# Altium schematic sheet Mach_PCB.SchDoc
size A4
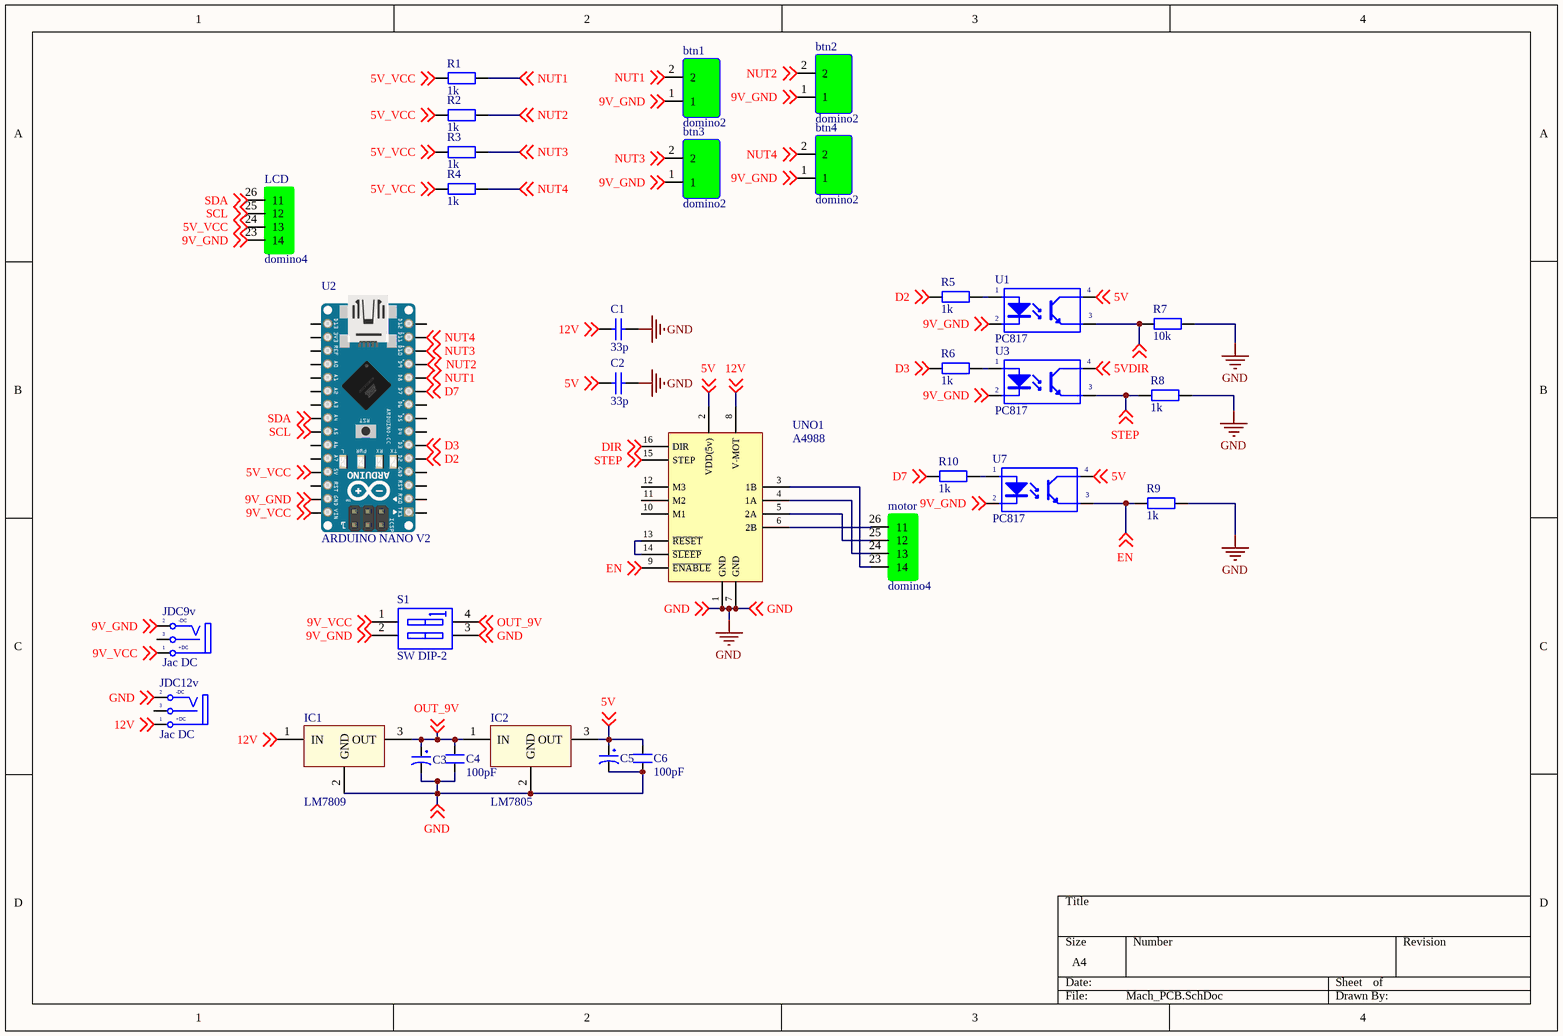
[diagram p0: Mach_PCB.SchDoc]

## Parts
btn1  domino2  [domino2]
btn2  domino2  [domino2]
btn3  domino2  [domino2]
btn4  domino2  [domino2]
C1  value 33p  [Tu-ceramic]  (hidden comment: Capacitor Ceramic)
C2  value 33p  [Tu-ceramic]  (hidden comment: Capacitor Ceramic)
C3  100uF/35V  [CP1.5/3.4]  (value not drawn)
C4  100pF  [CN1]
C5  100uF/35V  [CP1.5/3.4]  (value not drawn)
C6  100pF  [CN1]
IC1  LM7809  [QTO-220]
IC2  LM7805  [QTO-220]
JDC9v  Jac DC  [DC-IN]
JDC12v  Jac DC  [DC-IN]
LCD  domino4  [domino4]
motor  domino4  [domino4]
R1  1k  [R1/4W]
R2  1k  [R1/4W]
R3  1k  [R1/4W]
R4  1k  [R1/4W]
R5  1k  [R1/4W]
R6  1k  [R1/4W]
R7  10k  [R1/4W]
R8  1k  [R1/4W]
R9  1k  [R1/4W]
R10  1k  [R1/4W]
S1  SW DIP-2  [DIP2]
U1  PC817  [DIP4/W0.3]
U2  ARDUINO NANO V2  [ARDUINO NANO]
U3  PC817  [DIP4/W0.3]
U7  PC817  [DIP4/W0.3]
UNO1  A4988  [A4988(driver)]

## Nets
GND: C1.1 C2.1 C3.2 C4.2 C5.2 C6.2 IC1.2(GND) IC2.2(GND) JDC12v.2(TN) R7.2 R8.2 R9.2 S1.3(B2) UNO1.1(GND) UNO1.7(GND) ; off-sheet GND
5V: C2.2 C5.1 C6.1 IC2.3(OUT) U1.4(C) U3.4(C) U7.4(C) UNO1.2(VDD(5v)) ; off-sheet 5V
5V_VCC: LCD.24(13) R1.1 R2.1 R3.1 R4.1 U2.27(5V) ; off-sheet 5V_VCC
9V_GND: btn1.1 btn2.1 btn3.1 btn4.1 JDC9v.2(TN) LCD.23(14) S1.2(A2) U1.2(K) U2.29(GND) U3.2(K) U7.2(K) ; off-sheet 9V_GND
9V_VCC: JDC9v.1(T) S1.1(A1) U2.30(VIN) ; off-sheet 9V_VCC
12V: C1.2 IC1.1(IN) JDC12v.1(T) UNO1.8(V-MOT) ; off-sheet 12V
D2: R5.1 U2.5(D2) ; off-sheet D2
D3: R6.1 U2.6(D3) ; off-sheet D3
D7: R10.1 U2.10(D7) ; off-sheet D7
DIR: R7.1 U1.3(E) UNO1.16(DIR) ; off-sheet DIR
EN: R9.1 U7.3(E) UNO1.9(~{ENABLE}) ; off-sheet EN
NUT1: btn1.2 R1.2 U2.11(D8) ; off-sheet NUT1
NUT2: btn2.2 R2.2 ; off-sheet NUT2
NUT3: btn3.2 R3.2 U2.13(D10) ; off-sheet NUT3
NUT4: btn4.2 R4.2 U2.14(D11) ; off-sheet NUT4
OUT_9V: C3.1 C4.1 IC1.3(OUT) IC2.1(IN) S1.4(B1) ; off-sheet OUT_9V
SCL: LCD.25(12) U2.24(A5) ; off-sheet SCL
SDA: LCD.26(11) U2.23(A4) ; off-sheet SDA
STEP: R8.1 U3.3(E) UNO1.15(STEP) ; off-sheet STEP
Netmotor_23: motor.23(14) UNO1.3(1B)
Netmotor_24: motor.24(13) UNO1.4(1A)
Netmotor_25: motor.25(12) UNO1.5(2A)
Netmotor_26: motor.26(11) UNO1.6(2B)
NetR5_2: R5.2 U1.1(A)
NetR6_2: R6.2 U3.1(A)
NetR10_2: R10.2 U7.1(A)
NetUNO1_13: UNO1.13(~{RESET}) UNO1.14(~{SLEEP})

Not connected (* = marked no-connect by the designer): JDC9v 3(S); JDC12v 3(S); U2 1(TX) 2(RX) 4(GND) 7(D4) 8(D5) 9(D6) 12(D9) 15(D12) 16(D13) 17(3V3) 18(AREF) 19(A0) 20(A1) 21(A2) 22(A3) 25(A6) 26(A7) 28(RST) RST(3); UNO1 10(M1) 11(M2) 12(M3)

## Notes on the sheet
- Labels drawn without touching a wire or pin: NUT2
- (in symbol DCIN) -DC; +DC

## Library data of the parts
C1 C2 = CapDecop: Capacitor; Published: 8-Jun-2000; LatestRevisionDate: 17-Jul-2002; LatestRevisionNote: Re-released for DXP Platform.; PackageReference: RAD-0.3; Publisher: Altium Limited
C3 C5 = CP3: Cap 100uF/35V - 470uF/16V; Value: 100uF/35V/50V; Description 1: 1000uF/6,3V - 470uF/16V - 330uF - 25V; Description 2: 220uF/35V - 100uF/50V - 63V - 4,7uF/200V; Description 3: 22uF => 33uF100V - 3,3uF => 4,7uF/250V; Description 4: 2,2uF =>3,3uF/350 - 2,2uF/400V - 1uF/450V
C4 C6 = CN1: Cap np  1pF - 472pF; Value: 100pF
IC1 = LM78xx: On ap +, from + 5 to + 24VDC; Value: LM7805
IC2 = LM78xx: On ap +, from + 5 to + 24VDC; Value: LM7805
JDC9v JDC12v = DCIN: Jac DC input; Value: Jac DC
R1-R10 = R1/4W: Resistor 1/4W; Value: R1/4W - 1K
S1 = SW DIP-2: DIP Switch, 2 Position, SPST; Published: 24-Mar-1999; LatestRevisionDate: 17-Jul-2002; LatestRevisionNote: Re-released for DXP Platform.; PackageReference: DIP-4; Publisher: Altium Limited
U1 U3 U7 = PC817: Single Opto; Value: PC817